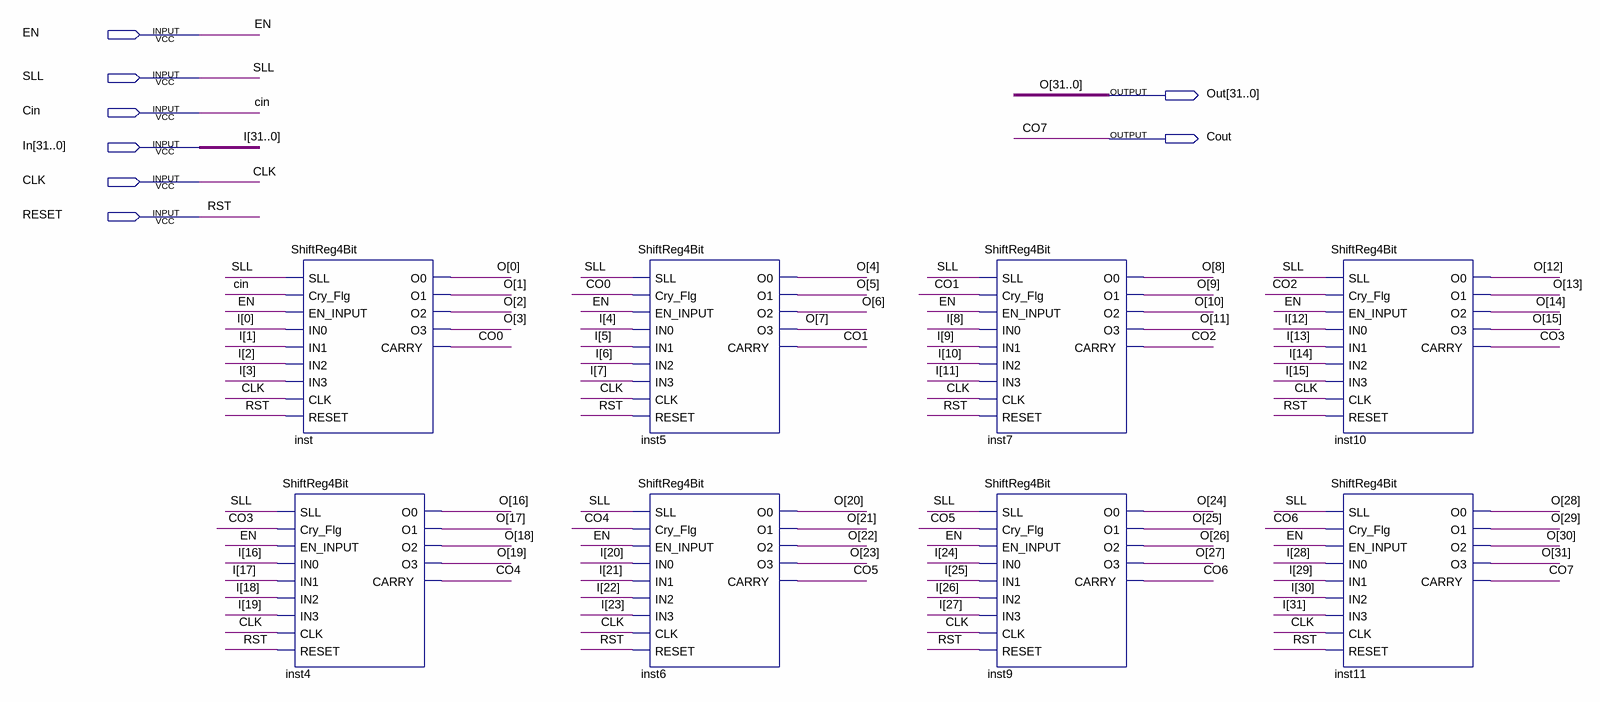
[diagram p0: schematic sheet]
// Quartus schematic SLR.bdf as structural Verilog: 8 symbols, 8 pins
module SLR (
  input  EN,
  input  SLL,
  input  Cin,
  input  [31:0] In,
  input  CLK,
  input  RESET,
  output [31:0] Out,
  output Cout
);

  wire CO0, CO1, CO2, CO3, CO4, CO5, CO6;

  ShiftReg4Bit inst4 (
    .SLL(SLL), .Cry_Flg(CO3), .EN_INPUT(EN), .IN0(In[16]), .IN1(In[17]), .IN2(In[18]), .IN3(In[19]),
    .CLK(CLK), .RESET(RESET), .O0(Out[16]), .O1(Out[17]), .O2(Out[18]), .O3(Out[19]), .CARRY(CO4));
  ShiftReg4Bit inst (
    .SLL(SLL), .Cry_Flg(Cin), .EN_INPUT(EN), .IN0(In[0]), .IN1(In[1]), .IN2(In[2]), .IN3(In[3]), .CLK(CLK),
    .RESET(RESET), .O0(Out[0]), .O1(Out[1]), .O2(Out[2]), .O3(Out[3]), .CARRY(CO0));
  ShiftReg4Bit inst5 (
    .SLL(SLL), .Cry_Flg(CO0), .EN_INPUT(EN), .IN0(In[4]), .IN1(In[5]), .IN2(In[6]), .IN3(In[7]), .CLK(CLK),
    .RESET(RESET), .O0(Out[4]), .O1(Out[5]), .O2(Out[6]), .O3(Out[7]), .CARRY(CO1));
  ShiftReg4Bit inst6 (
    .SLL(SLL), .Cry_Flg(CO4), .EN_INPUT(EN), .IN0(In[20]), .IN1(In[21]), .IN2(In[22]), .IN3(In[23]),
    .CLK(CLK), .RESET(RESET), .O0(Out[20]), .O1(Out[21]), .O2(Out[22]), .O3(Out[23]), .CARRY(CO5));
  ShiftReg4Bit inst7 (
    .SLL(SLL), .Cry_Flg(CO1), .EN_INPUT(EN), .IN0(In[8]), .IN1(In[9]), .IN2(In[10]), .IN3(In[11]), .CLK(CLK),
    .RESET(RESET), .O0(Out[8]), .O1(Out[9]), .O2(Out[10]), .O3(Out[11]), .CARRY(CO2));
  ShiftReg4Bit inst9 (
    .SLL(SLL), .Cry_Flg(CO5), .EN_INPUT(EN), .IN0(In[24]), .IN1(In[25]), .IN2(In[26]), .IN3(In[27]),
    .CLK(CLK), .RESET(RESET), .O0(Out[24]), .O1(Out[25]), .O2(Out[26]), .O3(Out[27]), .CARRY(CO6));
  ShiftReg4Bit inst10 (
    .SLL(SLL), .Cry_Flg(CO2), .EN_INPUT(EN), .IN0(In[12]), .IN1(In[13]), .IN2(In[14]), .IN3(In[15]),
    .CLK(CLK), .RESET(RESET), .O0(Out[12]), .O1(Out[13]), .O2(Out[14]), .O3(Out[15]), .CARRY(CO3));
  ShiftReg4Bit inst11 (
    .SLL(SLL), .Cry_Flg(CO6), .EN_INPUT(EN), .IN0(In[28]), .IN1(In[29]), .IN2(In[30]), .IN3(In[31]),
    .CLK(CLK), .RESET(RESET), .O0(Out[28]), .O1(Out[29]), .O2(Out[30]), .O3(Out[31]), .CARRY(Cout));

  // Other names for the same wires on the sheet: CO7 = Cout; I[31:0] = In; O[31:0] = Out; RST = RESET
endmodule
